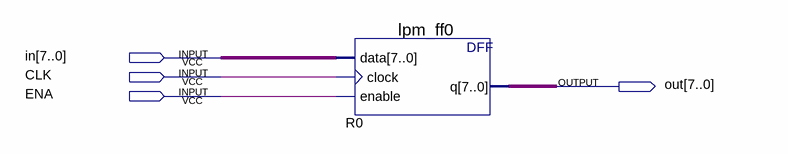
[diagram p0: schematic sheet]
// Quartus schematic reg_test.bdf as structural Verilog: 1 symbols, 4 pins
module reg_test (
  input  [7:0] in,
  input  CLK,
  input  ENA,
  output [7:0] out
);

  lpm_ff0 R0 (.data(in), .clock(CLK), .enable(ENA), .q(out));
endmodule
